# EAGLE design s2-adapter (EAGLE 7.1.0)
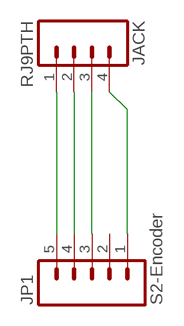
[diagram p0: schematic, sheet 1]

## Parts
JACK  RJ9PTH  [RJ9]
JP1  S2-Encoder  M05NO_SILK  [1X05_NO_SILK]

## Nets
+5V: JACK.2 JP1.4
CHANA: JACK.3 JP1.3
CHANB: JACK.1 JP1.5
GND: JACK.4 JP1.1
Unconnected: JP1.2

## Library data of the parts
JACK = SparkFun-Connectors:RJ9: RJ9 connector (e.g., phone handsets)
JP1 = SparkFun-Connectors:M05: Header 5 Standard 5-pin 0.1" header. Use with straight break away headers (SKU : PRT-00116), right angle break away headers (PRT-00553), swiss pins (PRT-00743), machine pins (PRT-00117), and female headers (PRT-00115). Molex polarized connector foot print use with SKU : PRT-08230 with associated crimp pins and housings.

## Board
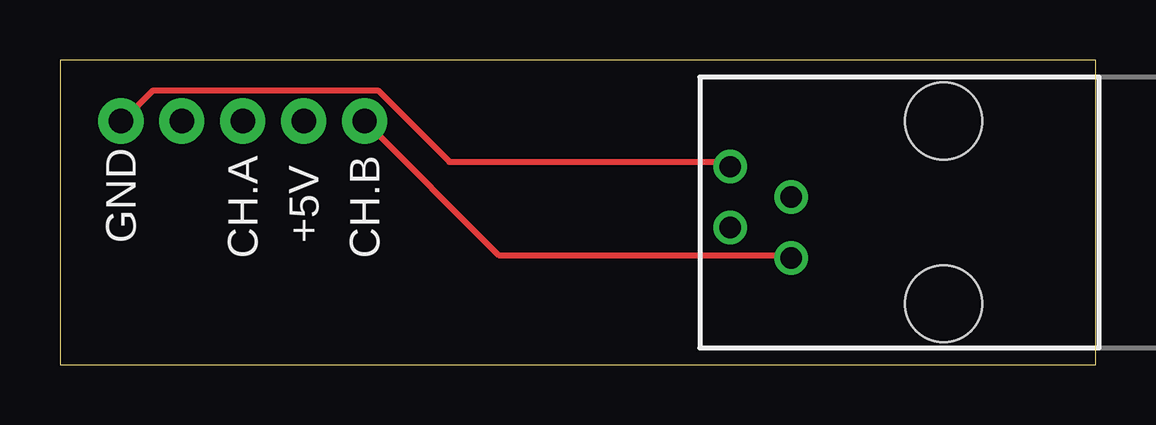
[diagram p1: board, top side]
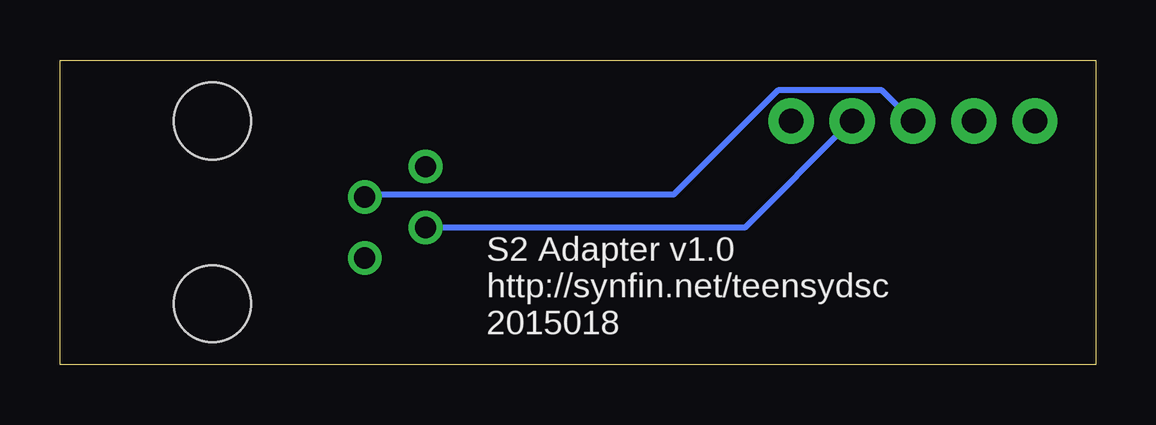
[diagram p2: board, bottom side, seen from below]

Size 43.18 x 12.7 mm. Coordinates in mm from the lower left corner, seen from the top.
Outline: 0,0 43.18,0 43.18,12.7 0,12.7 0,0
Copper layers (1*16): Top 0.035mm / dielectric 1.5mm / Bottom 0.035mm
Design rules "default": minimum track width 10mil, minimum drill 24mil, track to track 8mil, track to pad 8mil, pad to pad 8mil, via to via 8mil, smd to smd 8mil, copper to edge 40mil, drill to drill 8mil, minimum pad ring 10mil, minimum via ring 8mil, stop-mask expansion 4mil, vias tented up to drill 0mil, thermal gap 10mil

### Footprints (pad centres in the part's own frame; a part is rotated, then mirrored left to right if it is on the bottom)
RJ9 = drill 0.889: 1 -1.905,6.35; 2 -0.635,8.89; 3 0.635,6.35; 4 1.905,8.89 | hole 3.2: -3.81,0; 3.81,0
1X05_NO_SILK = drill 1.016 pad 1.88: 1 0,0; 2 2.54,0; 3 5.08,0; 4 7.62,0; 5 10.16,0

### Placement (x,y rotation side)
JACK  36.83,6.35 90 top
JP1  2.54,10.16 0 top

### Tracks (layer width: path | path; a pad name or v marks a point on that pad's centre or on a via)
+5V
  Bottom 0.254: JACK.2 14.63,5.71 10.29,10.06 JP1.4
CHANA
  Bottom 0.254: JACK.3 30.4,7.09 17.6,7.09 13.26,11.43 8.91,11.43 7.77,10.29 JP1.3
CHANB
  Top 0.254: JP1.5 18.29,4.57 30.4,4.57 JACK.1
GND
  Top 0.254: JACK.4 27.89,8.46 16.23,8.46 13.26,11.43 3.89,11.43 2.74,10.29 JP1.1

### Text on the board
tPlace: GND | +5V | CH.A | CH.B
bPlace: S2 Adapter v1.0 / http://synfin.net/teensydsc / 2015018